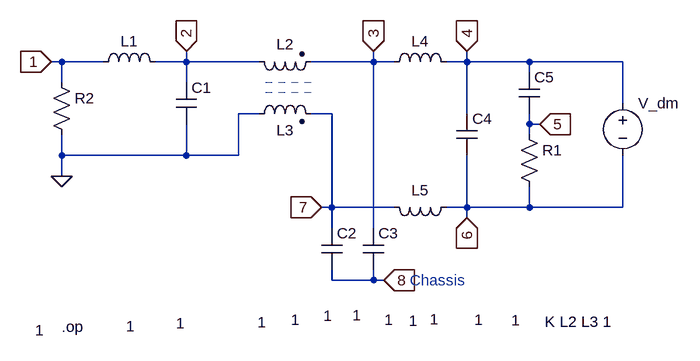
[diagram p0: schematic mathematical_analysis_of_a_combined_filter_v1_DM.asc]
mathematical_analysis_of_a_combined_filter_v1_DM.asc, the LTspice schematic file:
Version 4
SHEET 1 1068 680
WIRE -96 80 -112 80
WIRE -32 80 -96 80
WIRE 96 80 96 64
WIRE 96 80 48 80
WIRE 208 80 96 80
WIRE 384 80 384 64
WIRE 384 80 288 80
WIRE 416 80 384 80
WIRE 528 80 528 64
WIRE 528 80 496 80
WIRE 624 80 528 80
WIRE 768 80 624 80
WIRE 624 96 624 80
WIRE -96 112 -96 80
WIRE 96 112 96 80
WIRE 768 144 768 80
WIRE 208 160 176 160
WIRE 320 160 288 160
WIRE 528 160 528 80
WIRE 624 176 624 160
WIRE 640 176 624 176
WIRE 624 192 624 176
WIRE -96 224 -96 192
WIRE 96 224 96 176
WIRE 96 224 -96 224
WIRE 176 224 176 160
WIRE 176 224 96 224
WIRE -96 256 -96 224
WIRE 320 304 320 160
WIRE 320 304 304 304
WIRE 416 304 320 304
WIRE 528 304 528 224
WIRE 528 304 496 304
WIRE 624 304 624 272
WIRE 624 304 528 304
WIRE 768 304 768 224
WIRE 768 304 624 304
WIRE 528 320 528 304
WIRE 320 336 320 304
WIRE 384 336 384 80
WIRE 320 416 320 400
WIRE 384 416 384 400
WIRE 384 416 320 416
WIRE 400 416 384 416
FLAG -96 256 0
FLAG -112 80 1
IOPIN -112 80 In
FLAG 96 64 2
IOPIN 96 64 In
FLAG 304 304 7
IOPIN 304 304 In
FLAG 384 64 3
IOPIN 384 64 In
FLAG 528 64 4
IOPIN 528 64 In
FLAG 528 320 6
IOPIN 528 320 In
FLAG 640 176 5
IOPIN 640 176 In
FLAG 400 416 8
IOPIN 400 416 In
SYMBOL ind -48 96 R270
WINDOW 0 32 56 VTop 2
WINDOW 3 -375 58 VBottom 2
SYMATTR InstName L1
SYMATTR Value 1
SYMBOL ind2 192 64 M90
WINDOW 0 5 56 VBottom 2
WINDOW 3 401 20 VTop 2
SYMATTR InstName L2
SYMATTR Value 1
SYMATTR Type ind
SYMBOL ind2 192 176 R270
WINDOW 0 -25 56 VTop 2
WINDOW 3 -285 72 VBottom 2
SYMATTR InstName L3
SYMATTR Value 1
SYMATTR Type ind
SYMBOL ind 400 96 R270
WINDOW 0 32 56 VTop 2
WINDOW 3 -367 45 VBottom 2
SYMATTR InstName L4
SYMATTR Value 1
SYMBOL ind 512 288 R90
WINDOW 0 5 56 VBottom 2
WINDOW 3 173 104 VTop 2
SYMATTR InstName L5
SYMATTR Value 1
SYMBOL cap 80 112 R0
WINDOW 3 0 370 Left 2
SYMATTR Value 1
SYMATTR InstName C1
SYMBOL cap 304 336 R0
WINDOW 3 3 135 Left 2
SYMATTR Value 1
SYMATTR InstName C2
SYMBOL cap 368 336 R0
WINDOW 3 -16 134 Left 2
SYMATTR Value 1
SYMATTR InstName C3
SYMBOL cap 512 160 R0
WINDOW 3 -41 316 Left 2
SYMATTR Value 1
SYMATTR InstName C4
SYMBOL cap 608 96 R0
WINDOW 3 -12 382 Left 2
SYMATTR Value 1
SYMATTR InstName C5
SYMBOL res 608 176 R0
WINDOW 3 -69 301 Left 2
SYMATTR Value 1
SYMATTR InstName R1
SYMBOL voltage 768 128 R0
WINDOW 3 24 96 Invisible 2
WINDOW 123 0 0 Left 0
WINDOW 39 0 0 Left 0
SYMATTR Value 1
SYMATTR InstName V_dm
SYMBOL res -112 96 R0
WINDOW 3 -25 397 Left 2
SYMATTR Value 1
SYMATTR InstName R2
TEXT 648 480 Left 2 !K L2 L3 1
TEXT -96 488 Left 2 !.op
TEXT 440 416 Left 2 ;Chassis
LINE Normal 288 112 208 112 2
LINE Normal 288 112 288 112 2
LINE Normal 288 112 288 112 2
LINE Normal 288 112 288 112 2
LINE Normal 288 112 288 112 2
LINE Normal 288 112 288 112 2
LINE Normal 288 128 208 128 2
LINE Normal 288 128 288 128 2
LINE Normal 288 128 288 128 2
LINE Normal 288 128 288 128 2

The netlist it stands for:
* mathematical_analysis_of_a_combined_filter_v1_DM.asc
L1 1 2 1
L2 2 3 1
L3 0 7 1
L4 3 4 1
L5 6 7 1
C1 2 0 1
C2 7 8 1
C3 3 8 1
C4 4 6 1
C5 4 5 1
R1 5 6 1
V_dm 4 6 1
R2 1 0 1
K L2 L3 1
.op
* Chassis
.backanno
.end